# EAGLE design Enclosure 130x95 BPHC (EAGLE 9.6.2)
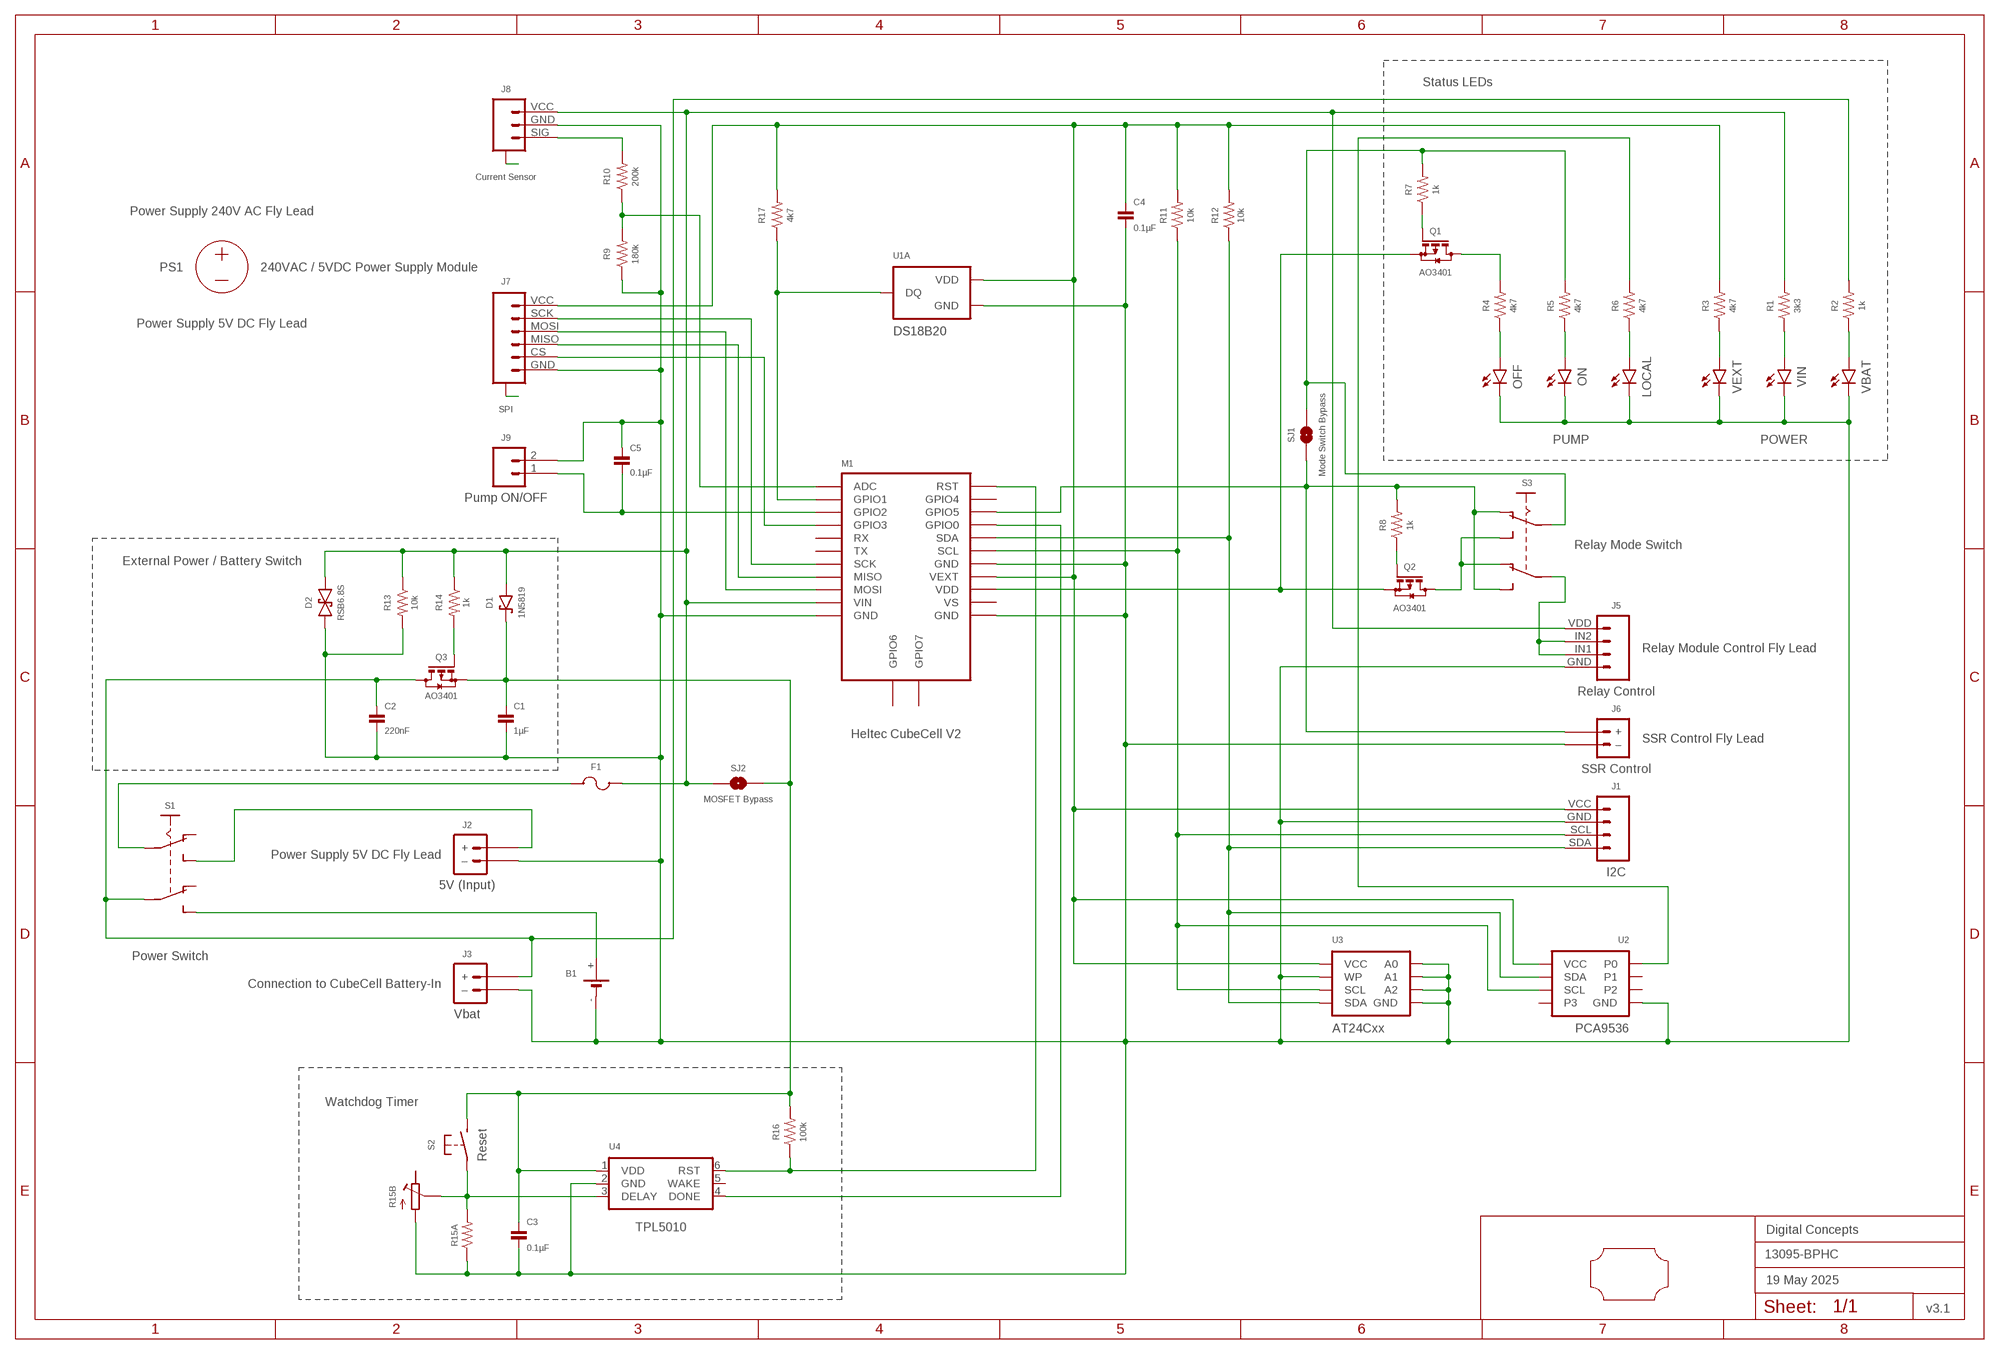
[diagram p0: schematic, sheet 1]
FRAME2 (A3L-LOC): DATE: 19 May 2025; OWNER: Digital Concepts; TITLE: 13095-BPHC; VERSION: v3.1

## Parts
B1  BATTERY-HOLDER-14500(AA)  [BATTERY-14500]
C1  1µF  CAPACITOR-0805  [C0805]
C2  220nF  CAPACITOR-0805  [C0805]
C3  0.1µF  CAPACITOR-0805  [C0805]
C4  0.1µF  CAPACITOR-0805  [C0805]
C5  0.1µF  CAPACITOR-0805  [C0805]
D1  1N5819  DIODE-SCHOTTKY-1N5819  [SOD-123]
D2  RSB6.8S  DIODE-SCHOTTKY-BIDIRECTIONAL  [VMD2]
F1  Fuse  MF-PSMF050X-2  [F0805]
J1  I2C  HEADER-1X4-I2C  [CONN_04-I2C]
J2  5V (Input)  JST-PH2.0-2-VERTICAL-POWER  [JST-PH2.0-2-VERTICAL-POWER]
J3  Vbat  JST-GH1.25-2-HORIZONTAL-POWER  [JST-GH1.25-2-HORIZONTAL]
J5  Relay Control  JST-PH2.0-4-HORIZONTAL-RELAY  [JST-PH2.0-4-HORIZONTAL-RELAY]
J6  SSR Control  JST-PH2.0-2-H-POWER  [JST-PH2.0-2-HORIZONTAL-POWER]
J7  SPI  JST-SH1.0-6-SMD-HORIZONTAL-SPI  [JST-SH1.0-6-HORIZONTAL-SPI]
J8  Current Sensor  JST-SH1.0-3-SMD-HORIZONTAL-SIG  [JST-SH1.0-3-HORIZONTAL-SIG]
J9  Pump ON/OFF  HEADER-1X2-GENERIC  [CONN_02-GENERIC]
LOCAL  LEDCHIP-LED0805  [CHIP-LED0805]
M1  Heltec CubeCell V2  HELTEC-CUBECELL  [HELTEC-CUBECELL]
OFF  LEDCHIP-LED0805  [CHIP-LED0805]
ON  LEDCHIP-LED0805  [CHIP-LED0805]
PCB1  PCB-OUTLINE-130X95-HALF-TOP  [PROTO-130X95-OUTLINE-HALF-TOP]
PS1  240VAC / 5VDC Power Supply Module  POWER_SUPPLY_MODULE  [AC_DC_POWER_SUPPLY]
Q1  AO3401  MOSFET-AO3401  [SOT-23]
Q2  AO3401  MOSFET-AO3401  [SOT-23]
Q3  AO3401  MOSFET-AO3401  [SOT-23]
R1  3k3  RESISTORR0805  [R0805]
R2  1k  RESISTORR0805  [R0805]
R3  4k7  RESISTORR0805  [R0805]
R4  4k7  RESISTORR0805  [R0805]
R5  4k7  RESISTORR0805  [R0805]
R6  4k7  RESISTORR0805  [R0805]
R7  1k  RESISTORR0805  [R0805]
R8  1k  RESISTORR0805  [R0805]
R9  180k  RESISTORR0805  [R0805]
R10  200k  RESISTORR0805  [R0805]
R11  10k  RESISTORR0805  [R0805]
R12  10k  RESISTORR0805  [R0805]
R13  10k  RESISTORR0805  [R0805]
R14  1k  RESISTORR0805  [R0805]
R15A  RESISTORR0805  [R0805]
R15B  RESISTOR-TRIMM-33  [RTRIM3*3]
R16  100k  RESISTORR0805  [R0805]
R17  4k7  RESISTORR0805  [R0805]
S1  Power Switch  SWITCH-SLIDE-DPDT-PTH  [SWITCH-DPDT-PTH]
S2  Reset  SWITCH-MOMENTARY-2-PIN  [SWITCH-2-PAD]
S3  Relay Mode Switch  SWITCH-SLIDE-DPDT-SMT  [SWITCH-DPDT-SMD]
SJ1  Mode Switch Bypass  SJ  [SJ]
SJ2  MOSFET Bypass  SJ  [SJ]
U1A  DS18B20  THERMOMETER-DS18B20  [TO-92]
U2  PCA9536  PCA9536-I2C-GPIO4  [SOP-8]
U3  AT24Cxx  AT24CXX-EEPROM  [SOP-8]
U4  TPL5010  TPL5010DDCR  [SOT-23-6]
VBAT  LEDCHIP-LED0805  [CHIP-LED0805]
VEXT  LEDCHIP-LED0805  [CHIP-LED0805]
VIN  LEDCHIP-LED0805  [CHIP-LED0805]

## Nets
A6: J8.A@1(A) J8.A@3(A)
A8: J7.A@1(A) J7.A@6(A)
GND: B1.- C1.2 C2.2 C3.2 C4.2 C5.1 D2.P$2 J1.GND J2.-(–) J3.-(–) J5.GND J6.-(–) J7.GND J8.GND J9.2 LOCAL.C M1.GND@11(GND) M1.GND@14(GND) M1.GND@18(GND) OFF.C ON.C R9.1 R13.2 R15A.1 R15B.1(A) U1A.1(GND) U2.4(GND) U3.1(A0) U3.2(A1) U3.3(A2) U3.4(GND) U3.7(WP) U4.2(GND) VBAT.C VEXT.C VIN.C
N$1: R6.2 U2.1(P0)
N$2: B1.+ S1.P$6(S2)
N$3: C5.2 J9.1 M1.GPIO2
N$4: C4.1 J1.VCC J7.VCC M1.VEXT R3.2 R11.2 R12.2 R17.2 U1A.3(VDD) U2.8(VCC) U3.8(VCC)
N$5: J1.SDA M1.SDA R12.1 U2.7(SDA) U3.5(SDA)
N$6: C1.1 C3.1 D1.C Q3.2(S) R16.2 S2.P$2(S) SJ2.2 U4.1(VDD)
N$7: J6.+ M1.GPIO5 R8.2 S3.P$1(O1) S3.P$6(S2) SJ1.1
N$8: M1.GPIO1 R17.1 U1A.2(DQ)
N$9: J1.SCL M1.SCL R11.1 U2.6(SCL) U3.6(SCL)
N$10: R2.1 VBAT.A
N$11: M1.GPIO0 U4.4(DONE)
N$12: OFF.A R4.1
N$13: R1.1 VIN.A
N$14: R3.1 VEXT.A
N$15: F1.2 S1.P$2(P1)
N$16: J2.+ S1.P$3(S1)
N$17: Q1.3(D) R4.2
N$18: M1.ADC R9.2 R10.1
N$19: ON.A R5.1
N$20: LOCAL.A R6.1
N$21: D1.A D2.P$1 F1.1 J5.VDD J8.VCC M1.VIN R1.2 R13.1 R14.1 SJ2.1
N$22: Q1.1(G) R7.1
N$23: Q2.3(D) S3.P$3(S1) S3.P$4(O2)
N$24: Q2.1(G) R8.1
N$25: J8.SIG R10.2
N$26: R5.2 R7.2 S3.P$2(P1) SJ1.2
N$27: J5.IN1 J5.IN2 S3.P$5(P2)
N$28: J7.SCK M1.SCK
N$29: J7.MOSI M1.MOSI
N$30: J7.MISO M1.MISO
N$31: J7.CS M1.GPIO3
N$34: C2.1 J3.+ Q3.3(D) R2.2 S1.P$5(P2)
N$36: R15A.2 R15B.2(S) S2.P$1(P) U4.3(DELAY)
N$37: M1.RST R16.1 U4.6(RST)
N$43: Q3.1(G) R14.2
VCC: M1.VDD Q1.2(S) Q2.2(S)
Unconnected: M1.GPIO4 M1.GPIO6 M1.GPIO7 M1.RX M1.TX M1.VS R15B.3(E) S1.P$1(O1) S1.P$4(O2) U2.2(P1) U2.3(P2) U2.5(P3) U4.5(WAKE)

## Notes on the sheet
- Status LEDs
- Power Supply 240V AC Fly Lead
- Power Supply 5V DC Fly Lead
- PUMP | POWER
- External Power / Battery Switch
- Relay Module Control Fly Lead
- SSR Control Fly Lead
- Power Supply 5V DC Fly Lead
- Connection to CubeCell Battery-In
- Watchdog Timer

## Library data of the parts
B1 = digitalconcepts:BATTERY-HOLDER-14500(AA): 14500 (AA) battery holder
C1-C5 = digitalconcepts:CAPACITOR-0805: 0805 Capacitor
D1 = digitalconcepts:DIODE-SCHOTTKY-1N5819: 1N5819 Schottky Diode SOD-123
D2 = digitalconcepts:DIODE-SCHOTTKY-BIDIRECTIONAL: Schottky Bidirectional Diode
F1 = digitalconcepts:MF-PSMF050X-2: PTC Resettable Fuse 0.5A/6V 500mA SMD
J1 = digitalconcepts:HEADER-1X4-I2C: I2C Interface [Pin 1 Vcc] 4-Pin Header
J2 = digitalconcepts:JST-PH2.0-2-VERTICAL-POWER: JST PH2.0 2P PTH Connector (Power)
J3 = digitalconcepts:JST-GH1.25-2-HORIZONTAL-POWER: JST GH1.25 2P PTH Connector (Power)
J5 = digitalconcepts:JST-PH2.0-4-HORIZONTAL-RELAY: PH2.0 4P Horizontal Connector with Relay Labels
J6 = digitalconcepts:JST-PH2.0-2-H-POWER: PH2.0 2P Right Angle Connector with power pin labelling
J7 = digitalconcepts:JST-SH1.0-6-SMD-HORIZONTAL-SPI: JST SH1.0 6P SMD SPI horizontal connector
J8 = digitalconcepts:JST-SH1.0-3-SMD-HORIZONTAL-SIG: JST SH1.0 3P SMD Horizontal Connector with Signal
J9 = digitalconcepts:HEADER-1X2-GENERIC: Single Row 2-Pin Header
LOCAL OFF ON VBAT VEXT VIN = digitalconcepts:LED: LED OSRAM: - CHIPLED LG R971, LG N971, LY N971, LG Q971, LY Q971, LO R971, LY R971 LH N974, LH R974 LS Q976, LO Q976, LY Q976 LO Q996 - Hyper CHIPLED LW Q18S LB Q993, LB Q99A, LB R99A - SideLED LS A670, LO A670, LY A670, LG A670, LP A670 LB A673, LV A673, LT A673, LW A673 LH A674 LY A675 LS A676, LA A676, LO A676, LY A676, LW A676 LS A679, LY A679, LG A679 - Hyper Micro SIDELED® LS Y876, LA Y876, LO Y876, LY Y876 LT Y87S - SmartLED LW L88C, LW L88S LB L89C, LB L89S, LG L890 LS L89K, LO L89K, LY L89K LS L896, LA L896, LO L896, LY L896 - TOPLED LS T670, LO T670, LY T670, LG T670, LP T670 LSG T670, LSP T670, LSY T670, LOP T670, LYG T670 LG T671, LOG T671, LSG T671 LB T673, LV T673, LT T673, LW T673 LH T674 LS T676, LA T676, LO T676, LY T676, LB T676, LH T676, LSB T676, LW T676 LB T67C, LV T67C, LT T67C, LS T67K, LO T67K, LY T67K, LW E67C LS E67B, LA E67B, LO E67B, LY E67B, LB E67C, LV E67C, LT E67C LW T67C LS T679, LY T679, LG T679 LS T770, LO T770, LY T770, LG T770, LP T770 LB T773, LV T773, LT T773, LW T773 LH T774 LS E675, LA E675, LY E675, LS T675 LS T776, LA T776, LO T776, LY T776, LB T776 LHGB T686 LT T68C, LB T68C - Hyper Mini TOPLED® LB M676 - Mini TOPLED Santana® LG M470 LS M47K, LO M47K, LY M47K Source: http://www.osram.convergy.de LUXEON: - LUMILED® LXK2-PW12-R00, LXK2-PW12-S00, LXK2-PW14-U00, LXK2-PW14-V00 LXK2-PM12-R00, LXK2-PM12-S00, LXK2-PM14-U00 LXK2-PE12-Q00, LXK2-PE12-R00, LXK2-PE12-S00, LXK2-PE14-T00, LXK2-PE14-U00 LXK2-PB12-K00, LXK2-PB12-L00, LXK2-PB12-M00, LXK2-PB14-N00, LXK2-PB14-P00, LXK2-PB14-Q00 LXK2-PR12-L00, LXK2-PR12-M00, LXK2-PR14-Q00, LXK2-PR14-R00 LXK2-PD12-Q00, LXK2-PD12-R00, LXK2-PD12-S00 LXK2-PH12-R00, LXK2-PH12-S00 LXK2-PL12-P00, LXK2-PL12-Q00, LXK2-PL12-R00 Source: www.luxeon.com KINGBRIGHT: KA-3528ASYC Source: www.kingbright.com
M1 = digitalconcepts:HELTEC-CUBECELL: Heltec CubeCell Development Board
PCB1 = digitalconcepts:PCB-OUTLINE-130X95-HALF-TOP: PCB half (sandwich top) enclosure (75 x 95) outline for 130 x 95 enclosure
PS1 = digitalconcepts:POWER_SUPPLY_MODULE: AC/DC Power Supply Module
Q1-Q3 = digitalconcepts:MOSFET-AO3401: AO3401 P-Channel MOSFET
R1-R14 R15A R16 R17 = digitalconcepts:RESISTOR: Resistor; SPICEPREFIX: R
R15B = digitalconcepts:RESISTOR-TRIMM-3*3: Trimm Resistor - 3*3 SMD
S1 = digitalconcepts:SWITCH-SLIDE-DPDT-PTH: Switch DPDT PTH
S2 = digitalconcepts:SWITCH-MOMENTARY-2-PIN: 2 Pin Momentary Switch
S3 = digitalconcepts:SWITCH-SLIDE-DPDT-SMT: Switch DPDT SMT
SJ1 SJ2 = digitalconcepts:SJ: Solder Jumper
U1A = digitalconcepts:THERMOMETER-DS18B20: Digital Thermometer -55C-125C TO92-3; AVAILABILITY: Bad; DESCRIPTION: Temperature Sensor Digital, Local -55°C ~ 125°C 12 b 8-uMAX; MF: Maxim Integrated; MP: DS18B20; PACKAGE: TO-92 Maxim Integrated; PRICE: None
U2 = digitalconcepts:PCA9536-I2C-GPIO4: PCA9536 4-bit I2C GPIO Expander
U3 = digitalconcepts:AT24CXX-EEPROM: AT24Cxx EEPROM SOP-8
U4 = digitalconcepts:TPL5010DDCR: TPL5010 Nano-Power System Timer with Watchdog

## Board
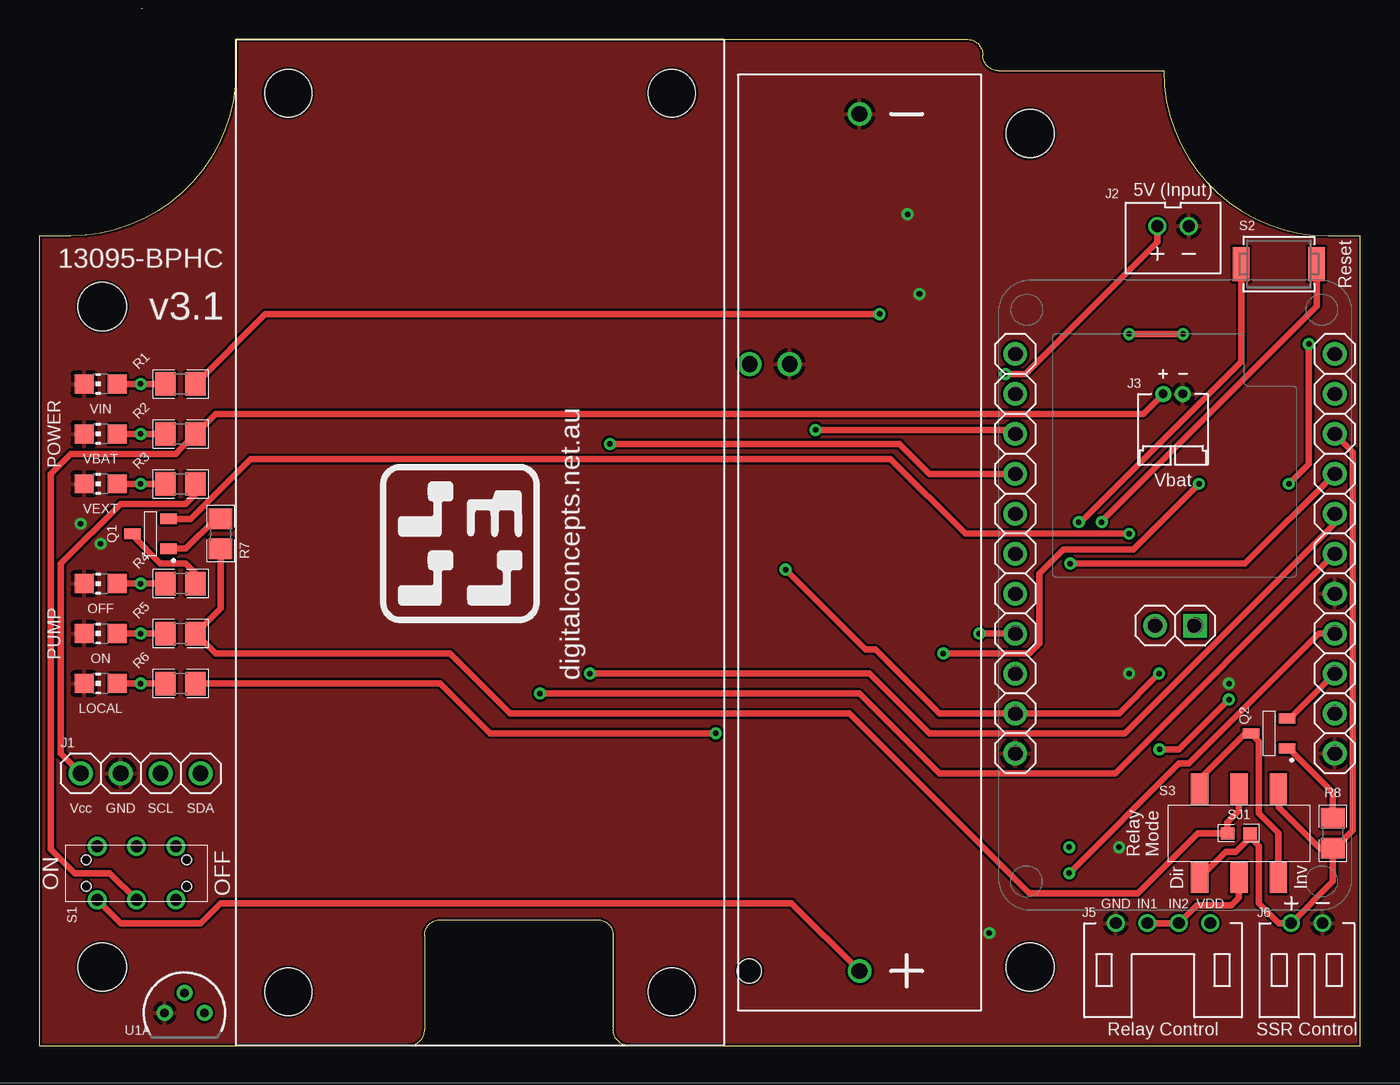
[diagram p1: board, top side]
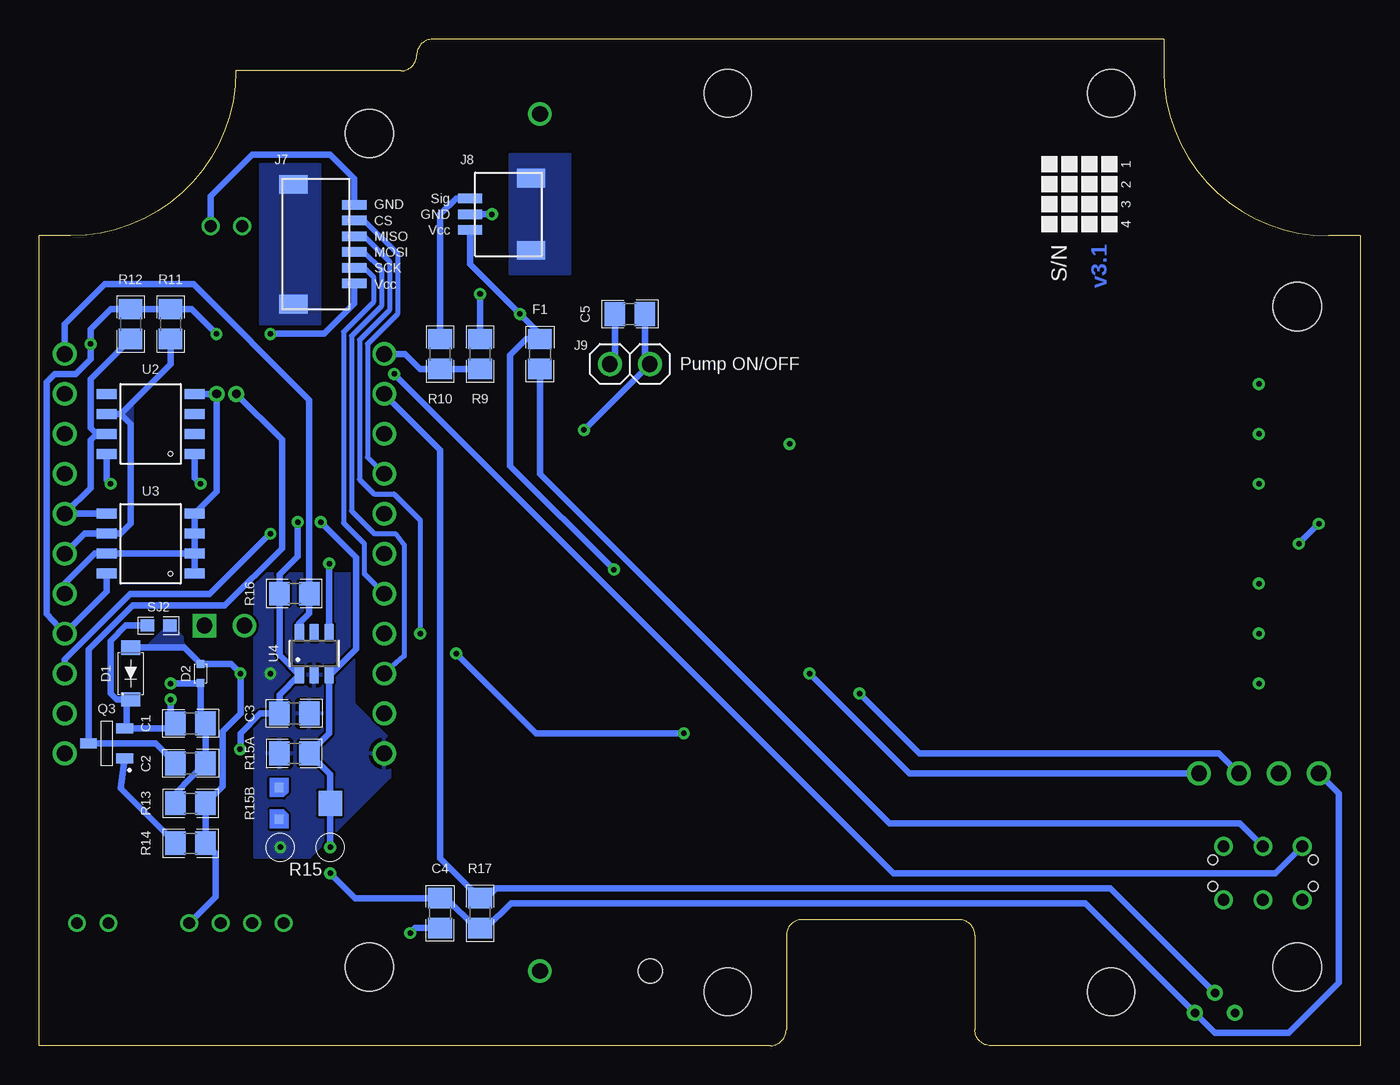
[diagram p2: board, bottom side, seen from below]

Size 84 x 64 mm. Coordinates in mm from the lower left corner, seen from the top.
Copper layers (1*16): Top 0.035mm / dielectric 1.5mm / Bottom 0.035mm
Design rules "default *": minimum track width 6mil, minimum drill 0.35mm, track to track 6mil, track to pad 6mil, pad to pad 6mil, via to via 6mil, smd to smd 6mil, copper to edge 6mil, drill to drill 6mil, minimum pad ring 1mil, minimum via ring 8mil, stop-mask expansion 4mil, vias tented up to drill 0mil, thermal gap 10mil

### Footprints (pad centres in the part's own frame; a part is rotated, then mirrored left to right if it is on the bottom)
BATTERY-14500 = drill 1: + -27.25,0; - 27.25,0 | hole 1.524: -27.25,7
C0805 = smd 1.3 x 1.5: 1 -0.95,0; 2 0.95,0
SOD-123 = smd 0.91 x 1.22: A -1.65,0; C 1.65,0
VMD2 = smd 0.5 x 0.5: P$1 -0.6,0; P$2 0.6,0
F0805 = smd 1.3 x 1.5: 1 -0.95,0; 2 0.95,0
CONN_04-I2C = drill 1 pad 1.524: GND 2.54,0; SCL 5.08,0; SDA 7.62,0; VCC 0,0
JST-PH2.0-2-VERTICAL-POWER = drill 0.75: + -1,0; - 1,0
JST-GH1.25-2-HORIZONTAL = drill 0.55 pad 1.016: + -0.625,0; - 0.625,0
JST-PH2.0-4-HORIZONTAL-RELAY = drill 0.75: GND 3,0; IN1 1,0; IN2 -1,0; VDD -3,0
JST-PH2.0-2-HORIZONTAL-POWER = drill 0.75: + 1,0; - -1,0
JST-SH1.0-6-HORIZONTAL-SPI = smd 1.2 x 1.8: A@1 -3.8,-1.335; A@6 3.8,-1.335 | smd 0.6 x 1.55: CS -1.5,2.54; GND -2.5,2.54; MISO -0.5,2.54; MOSI 0.5,2.54; SCK 1.5,2.54; VCC 2.5,2.54
JST-SH1.0-3-HORIZONTAL-SIG = smd 1.2 x 1.8: A@1 -2.3,-1.335; A@3 2.3,-1.335 | smd 0.6 x 1.55: GND 0,2.54; SIG 1,2.54; VCC -1,2.54
CONN_02-GENERIC = drill 1 pad 1.524: 1 0,0; 2 2.54,0
CHIP-LED0805 = smd 1.2 x 1.2: A 0,-1.05; C 0,1.05
HELTEC-CUBECELL = drill 1: ADC 0,0; GND@11 0,25.4; GND@14 -20.32,25.4; GND@18 -20.32,15.24; GPIO0 -20.32,7.62; GPIO1 0,2.54; GPIO2 0,5.08; GPIO3 0,7.62; GPIO4 -20.32,2.54; GPIO5 -20.32,5.08; GPIO6 -8.89,17.272; MISO 0,17.78; MOSI 0,20.32; RST -20.32,0; RX 0,10.16; SCK 0,15.24; SCL -20.32,12.7; SDA -20.32,10.16; TX 0,12.7; VDD -20.32,20.32; VEXT -20.32,17.78; VIN 0,22.86; VS -20.32,22.86 | drill 1 square: GPIO7 -11.43,17.272
PROTO-130X95-OUTLINE-HALF-TOP = hole 3.048: -38,10; 21,21; 21,-32; -38,-32
AC_DC_POWER_SUPPLY = hole 3: -28.575,12.192; -28.575,-12.192; 28.575,-12.192; 28.575,12.192
SOT-23 = smd 0.65 x 1.05: 1 -0.95,-1.15; 2 0.95,-1.15; 3 0,1.15
R0805 = smd 1.3 x 1.5: 1 -0.95,0; 2 0.95,0
RTRIM3*3 = smd 0.6 x 0.6: 1 -1,-1.6; 3 1,-1.6 | smd 1.6 x 1.5: 2 0,1.65
SWITCH-DPDT-PTH = drill 0.75 pad 1.19: P$1 -1.7,2.5; P$2 -1.7,0; P$3 -1.7,-2.5; P$4 1.7,2.5; P$5 1.7,0; P$6 1.7,-2.5 | hole 0.6: 0.85,3.2; -0.85,3.2; 0.85,-3.2; -0.85,-3.2
SWITCH-2-PAD = smd 1.067 x 2.184: P$1 -2.4,0; P$2 2.4,0
SWITCH-DPDT-SMD = smd 1.95 x 1.1: P$1 -2.825,2.5; P$2 -2.825,0; P$3 -2.825,-2.5; P$4 2.825,2.5; P$5 2.825,0; P$6 2.825,-2.5
SJ = smd 0.864 x 0.762: 1 -0.711,0; 2 0.711,0
TO-92 = drill 0.55 pad 1.016: 1 -1.27,0; 2 0,1.27; 3 1.27,0
SOP-8 = smd 0.635 x 1.27: 1 -1.905,-2.794; 2 -0.635,-2.794; 3 0.635,-2.794; 4 1.905,-2.794; 5 1.905,2.794; 6 0.635,2.794; 7 -0.635,2.794; 8 -1.905,2.794
SOT-23-6 = smd 1.1 x 0.6: 1 -1.35,0.95; 2 -1.35,0; 3 -1.35,-0.95; 4 1.35,-0.95; 5 1.35,0; 6 1.35,0.95

### Placement (x,y rotation side)
B1  52.16,32 90 top
C1  74.39,20.49 0 bottom
C2  74.39,17.95 0 bottom
C3  67.78,21.13 0 bottom
C4  58.51,8.43 270 bottom
C5  46.45,46.53 0 bottom
D1  78.19,23.67 270 bottom
D2  73.75,23.67 270 bottom
F1  52.16,43.98 270 bottom
J1  2.63,17.32 0 top
J2  72.1,52.11 0 top
J3  72.1,41.45 0 top
J5  71.46,7.79 180 top
J6  80.61,7.79 180 top
J7  66.51,50.97 270 bottom
J8  54.06,52.88 90 bottom
J9  45.17,43.35 180 bottom
LOCAL  3.9,23.03 90 top
M1  62.07,43.98 180 top
OFF  3.9,29.38 90 top
ON  3.9,26.21 90 top
PCB1  42,37 0 top
PS1  28.03,32 90 top
Q1  7.07,32.55 90 top
Q2  78.19,19.86 90 top
Q3  79.72,19.22 90 bottom
R1  8.98,42.08 0 top
R2  8.98,38.91 0 top
R3  8.98,35.73 0 top
R4  8.98,29.38 0 top
R5  8.98,26.21 0 top
R6  8.98,23.03 0 top
R7  11.52,32.55 270 top
R8  82.26,13.51 270 top
R9  55.97,43.98 270 bottom
R10  58.51,43.98 90 bottom
R11  75.66,45.89 90 bottom
R12  78.19,45.89 90 bottom
R13  74.39,15.41 180 bottom
R14  74.39,12.87 180 bottom
R15A  67.78,18.59 0 bottom
R15B  67.15,15.41 270 bottom
R16  67.78,28.75 180 bottom
R17  55.97,8.43 270 bottom
S1  6.19,10.97 270 top
S2  78.83,49.7 0 top
S3  76.29,13.51 270 top
SJ1  76.29,13.51 180 top
SJ2  76.42,26.71 180 bottom
U1A  9.23,2.08 0 top
U2  76.92,39.54 90 bottom
U3  76.92,31.92 90 bottom
U4  66.51,24.94 90 bottom
VBAT  3.9,38.91 90 top
VEXT  3.9,35.73 90 top
VIN  3.9,42.08 90 top

### Tracks (layer width: path | path; a pad name or v marks a point on that pad's centre or on a via)
A6
  pour Bottom (no thermals): 50.25,56.69 54.06,56.69 54.06,49.07 50.25,49.07
A8
  pour Bottom (no thermals): 69.94,56.05 69.94,45.89 66.13,45.89 66.13,56.05
GND  (via drill 0.35)
  Bottom 0.406: R13.2 75.33,16.05 74.33,17.05 74.33,17.06 C2.2 C1.2 73.75,20.81 D2.P$2 73.78,23.03 v75.66,23.03 | U3.2 U3.3 U3.4 72.72,35.23 J3.- U2.4 | U3.2 U3.1 | U3.2 U3.7 80.48,31.29 82.39,29.38 M1.GND@18 | v60.41,7.16 60.09,7.48 C4.2 | v2.63,33.19 v3.9,31.92 | C5.1 47.39,43.67 J9.2 | J2.- 73.1,54.02 70.46,56.65 65.5,56.65 63.97,55.12 J7.GND | v55.21,52.88 J8.GND | R9.1 v55.97,47.8
  other vias: 68.67,12.62 69.3,23.67
  pour Top (rank 5): -1.18,64.94 -1.18,-1.1 85.18,-1.1 85.18,64.94
  pour Bottom (rank 2): 70.32,30.02 70.32,11.98 66.77,11.98 61.69,17.06 61.69,19.47 63.97,21.76 63.97,30.02
  pour Bottom: 73.75,23.03 74.39,23.03 73.75,22.4
N$1  (via drill 0.35)
  Top 0.406: v43.02,19.86 28.66,19.86 25.49,23.03 R6.2 | v73.75,35.73 69.56,31.54 65.11,31.54 63.59,30.02 63.59,25.57 62.95,24.94 v57.49,24.94
  Bottom 0.406: U2.1 74.13,36.11 v73.75,35.73 | v57.49,24.94 52.41,19.86 v43.02,19.86
N$2
  Top 0.406: B1.+ 47.85,9.06 11.52,9.06 10.25,7.79 5.16,7.79 S1.P$6
N$3  (via drill 0.35)
  Top 0.406: M1.GPIO2 61.81,39.16 v49.37,39.16
  Bottom 0.406: v49.37,39.16 J9.1 45.49,43.67 C5.2
N$4  (via drill 0.35)
  Top 0.406: R3.2 9.93,35.09 9.3,34.46 5.17,34.46 1.36,30.65 1.36,18.59 J1.VCC | v80.73,44.62 80.73,37 v79.47,35.73 | v72.73,45.26 v69.3,45.26 | M1.VEXT 81.37,26.21 73.11,17.95 72.48,17.95 v65.5,10.97
  Bottom 0.406: U3.8 79.72,28.87 M1.VEXT 83.53,27.46 83.53,42.21 83.02,42.72 81.69,42.72 80.73,43.67 v80.73,44.62 80.73,45.57 79.47,46.84 R12.2 R11.2 74.32,46.84 v72.73,45.26 | v65.5,10.97 63.91,9.38 C4.1 58.13,9.38 56.23,7.48 R17.2 55.59,7.48 54,9.06 17.49,9.06 U1A.3 9.23,0.81 4.53,0.81 1.36,3.98 1.36,16.05 J1.VCC | U2.8 79.72,35.98 v79.47,35.73 | v69.3,45.26 68.94,45.3 65.88,45.3 63.97,47.2 J7.VCC
N$5  (via drill 0.35)
  Top 0.406: M1.SDA 82.39,33.22 69.02,19.86 56.61,19.86 52.8,23.67 v35.02,23.67
  Bottom 0.406: v35.02,23.67 28.66,17.32 J1.SDA | U3.5 M1.SDA 80.73,35.48 80.73,38.52 80.35,38.91 | 80.35,38.91 80.73,39.29 80.73,42.4 R12.1 | U2.7 80.35,38.91
N$6  (via drill 0.35)
  Top 0.406: v71.24,18.84 72.48,18.84 v75.66,22.01 | S2.P$2 81.23,47.02 67.56,33.36 v67.56,33.29
  Bottom 0.406: v75.66,22.01 75.66,20.81 C1.1 75.66,20.17 Q3.2 78.44,20.3 78.44,21.77 D1.C 79.08,22.02 79.47,22.4 79.47,25.74 78.49,26.71 SJ2.2 | v71.24,18.84 71.21,18.84 71.21,19.86 69.94,21.13 C3.1 68.73,22.32 U4.1 68.73,24.86 R16.2 68.73,29.95 67.56,31.12 v67.56,33.29
N$7
  Top 0.406: M1.GPIO5 83.53,37.76 83.53,13.7 82.39,12.56 R8.2 | S3.P$1 78.83,16.29 78.83,15.16 81.43,12.56 R8.2 | R8.2 82.26,10.44 J6.+ 78.83,7.79 77.56,9.06 77.56,12.69 77,13.25 SJ1.1 77,13.26 76.08,12.33 75.44,12.33 S3.P$6
N$8
  Bottom 0.406: U1A.2 15.9,10.01 54.95,10.01 55.59,9.38 R17.1 58.51,11.92 58.51,37.89 M1.GPIO1
N$9  (via drill 0.35)
  Top 0.406: M1.SCL 68.42,17.32 57.24,17.32 52.16,22.4 v31.84,22.4
  Bottom 0.406: M1.SCL 81.12,32.55 U3.6 78.83,32.55 78.19,33.19 78.19,39.54 78.83,40.18 | v31.84,22.4 28.03,18.59 8.98,18.59 J1.SCL | U2.6 78.83,40.18 | R11.1 75.66,43.35 78.83,40.18
  pour Bottom: 78.83,40.18 78.19,40.81 78.19,39.54
N$10  (via drill 0.35)
  Top 0.406: VBAT.A v6.44,38.91 R2.1
N$11  (via drill 0.35)
  Top 0.406: M1.GPIO0 76.67,30.65 v65.56,30.65
  Bottom 0.406: v65.56,30.65 U4.4
N$12  (via drill 0.35)
  Top 0.406: R4.1 v6.44,29.38 OFF.A
N$13  (via drill 0.35)
  Top 0.406: VIN.A v6.44,42.08 R1.1
N$14  (via drill 0.35)
  Top 0.406: R3.1 v6.44,35.73 VEXT.A
N$15
  Bottom 0.406: F1.2 52.16,36.37 29.94,14.14 7.66,14.14 S1.P$2
N$16  (via drill 0.35)
  Top 0.406: J2.+ 71.1,51.1 62.72,42.72 v61.43,42.72
  Bottom 0.406: v61.43,42.72 29.68,10.97 5.39,10.97 S1.P$3
N$17
  Top 0.406: R4.2 9.93,30.02 9.29,30.65 7.7,30.65 5.92,32.43 Q1.3
N$18
  Bottom 0.406: R9.2 R10.1 59.78,43.04 60.73,43.98 M1.ADC
N$19  (via drill 0.35)
  Top 0.406: R5.1 v6.44,26.21 ON.A
N$20  (via drill 0.35)
  Top 0.406: LOCAL.A v6.44,23.03 R6.1
N$21  (via drill 0.35)
  Top 0.406: v53.43,46.53 14.38,46.53 R1.2 | v47.46,30.27 52.54,25.19 53.18,25.19 57.24,21.13 M1.VIN 68.67,21.13 v71.21,23.67
  Bottom 0.406: D1.A 74.8,25.32 D2.P$1 71.81,24.27 v71.21,23.67 71.21,21.13 72.35,19.98 72.35,16.49 R13.1 R14.1 72.8,12.24 72.8,9.45 J5.VDD | v47.46,30.27 54.06,36.87 54.06,43.92 53.05,44.94 F1.1 52.16,45.26 v53.43,46.53 56.61,49.7 J8.VCC
  pour Bottom (no thermals): 74.8,25.32 75.02,25.57 75.02,25.95 75.4,26.33 76.04,26.33 77.05,25.32
N$22
  Top 0.406: Q1.1 9.3,31.61 11.2,33.51 R7.1
N$23
  Top 0.406: S3.P$4 78.79,13.55 77.55,14.78 77.55,19.35 Q2.3 76.68,19.86 73.79,16.97 S3.P$3
N$24
  Top 0.406: R8.1 82.26,16.11 79.47,18.91 Q2.1
N$25
  Bottom 0.406: J8.SIG 57.51,53.88 58.51,52.88 R10.2
N$26
  Top 0.406: R7.2 11.52,27.8 R5.2 11.2,24.94 26.12,24.94 29.94,21.13 51.52,21.13 62.95,9.7 69.86,9.7 73.67,13.51 SJ1.2 75.55,13.54 75.55,14.19 76.29,14.93 S3.P$2
N$27
  Top 0.406: J5.IN1 J5.IN2 73.61,8.93 75.81,8.93 76.29,9.41 S3.P$5
N$28
  Bottom 0.305: J7.SCK 63.34,49.47 62.75,48.89 62.75,47.29 64.66,45.38 64.66,33.24 63.34,31.92 63.34,30.02 M1.SCK
N$29
  Bottom 0.305: J7.MOSI 63.34,50.47 62.24,49.38 62.24,47.03 64.15,45.13 64.15,34 62.7,32.55 61.36,32.55 60.8,31.84 60.8,24.77 M1.MOSI
N$30  (via drill 0.35)
  Top 0.406: M1.MISO v59.78,26.21
  Bottom 0.305: J7.MISO 63.34,51.47 61.74,49.87 61.74,46.78 63.64,44.87 63.64,36.01 62.71,35.08 61.44,35.08 59.78,33.42 v59.78,26.21
N$31  (via drill 0.35)
  Top 0.406: v36.28,38.27 54.7,38.27 56.61,36.37 M1.GPIO3
  Bottom 0.305: M1.GPIO3 63.13,37.43 63.13,44.62 61.23,46.53 61.23,50.36 63.34,52.47 J7.CS
N$34
  Top 0.406: S1.P$5 4.49,10.97 2.25,10.97 0.72,12.49 0.72,36.37 1.99,37.64 8.66,37.64 9.04,38.01 R2.2 11.2,40.18 70.2,40.18 J3.+
  Bottom 0.406: C2.1 76.61,19.22 Q3.3 80.87,25.18 78.07,27.98 72.2,27.98 68.57,31.62 68.57,38.54 J3.+
N$36  (via drill 0.35)
  Top 0.406: S2.P$1 76.43,43.49 66.13,33.19 66.1,33.22 v66.1,33.29
  Bottom 0.406: v65.5,12.62 R15B.2 65.5,17.25 R15A.2 65.56,19.86 U4.3 65.5,23.59 63.84,25.24 63.84,31.04 v66.1,33.29
N$37
  Bottom 0.406: M1.RST 82.39,45.89 79.85,48.43 74.2,48.43 66.83,41.06 R16.1 66.83,27.48 67.46,26.85 U4.6
N$43
  Bottom 0.406: R14.2 78.82,16.36 Q3.1
VCC  (via drill 0.35)
  Top 0.406: v69.3,32.55 58.89,32.55 54.13,37.32 13.42,37.32 9.61,33.51 Q1.2 | M1.VDD 79.53,20.81 Q2.2
  Bottom 0.406: v69.3,32.55 73.15,28.71 78.23,28.71 82.39,24.55 M1.VDD

### Text on the board
Bottom: v3.1
tPlace: 13095-BPHC | digitalconcepts.net.au
bPlace: 1 | 2 | 3 | 4 | S/N
tNames: v3.1 | POWER | PUMP | Vcc | GND | SCL | SDA | Relay / Mode | ON | OFF | Dir | Inv
bNames: Sig | GND | GND | CS | Vcc | MISO | MOSI | SCK | Vcc | R15